# EAGLE design antenna (EAGLE 9.5.0)
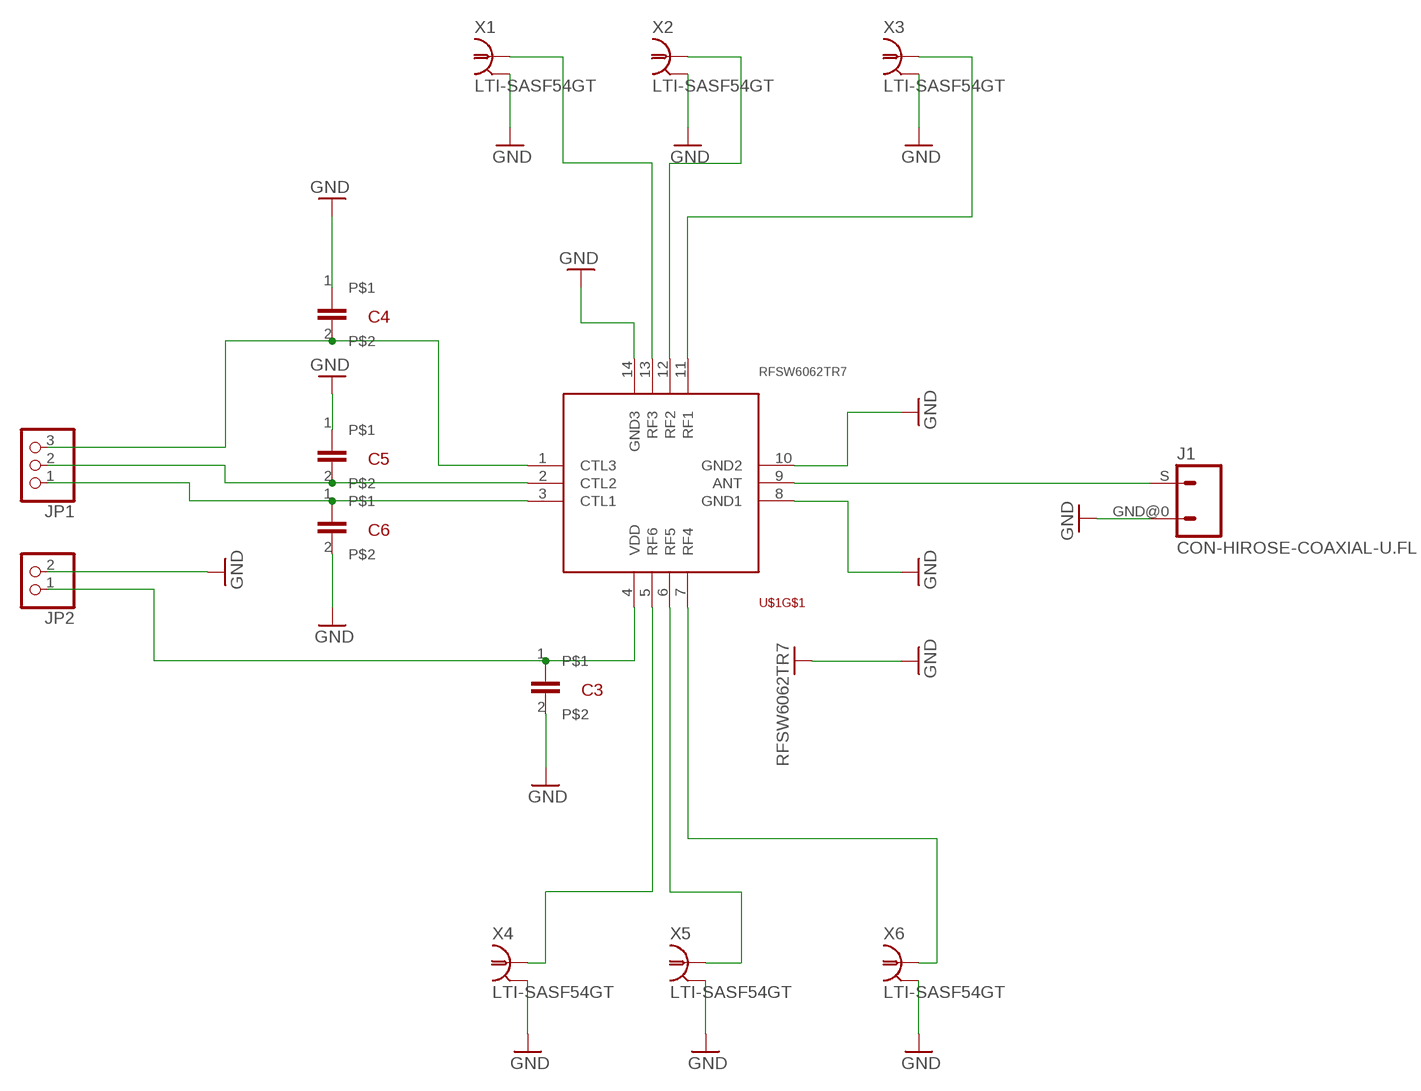
[diagram p0: schematic, sheet 1]

## Parts
C3  C3_0.01µF  [CAPC2012X78N]
C4  C8_100PF  [CAPC2012X78N]
C5  C8_100PF  [CAPC2012X78N]
C6  C8_100PF  [CAPC2012X78N]
J1  CON-HIROSE-COAXIAL-U.FL  [CON-U.FL]
JP1  PINHD-1X3  [1X03]
JP2  PINHD-1X2  [1X02]
U$1  RFSW6062TR7  [QFN40P200X200X55-15T98N]
X1  LTI-SASF54GT  [LTI-SASF54GT]
X2  LTI-SASF54GT  [LTI-SASF54GT]
X3  LTI-SASF54GT  [LTI-SASF54GT]
X4  LTI-SASF54GT  [LTI-SASF54GT]
X5  LTI-SASF54GT  [LTI-SASF54GT]
X6  LTI-SASF54GT  [LTI-SASF54GT]

## Nets
GND: C3.2 C4.1 C5.1 C6.2 J1.GND@0 JP2.2 U$1.8(GND1) U$1.10(GND2) U$1.14(GND3) U$1.15(GND) X1.2 X1.3 X1.4 X1.5 X2.2 X2.3 X2.4 X2.5 X3.2 X3.3 X3.4 X3.5 X4.2 X4.3 X4.4 X4.5 X5.2 X5.3 X5.4 X5.5 X6.2 X6.3 X6.4 X6.5
N$1: J1.S U$1.9(ANT)
N$3: C4.2 JP1.3 U$1.1(CTL3)
N$4: C5.2 JP1.2 U$1.2(CTL2)
N$5: C6.1 JP1.1 U$1.3(CTL1)
N$6: U$1.5(RF6) X4.1
N$7: U$1.6(RF5) X5.1
N$8: U$1.7(RF4) X6.1
N$9: U$1.13(RF3) X1.1
N$10: U$1.12(RF2) X2.1
N$11: U$1.11(RF1) X3.1
N$12: C3.1 JP2.1 U$1.4(VDD)

## Library data of the parts
C3 = CAPC3216X115N:C3_0.01µF: C0805X103J3GACTU 10 nF KEMET https://pl.mouser.com/ProductDetail/KEMET/C0805X103J3GACTU?qs=sGAEpiMZZMvsSlwiRhF8qtsBU8Zhqm2RMiIPEVgon9JfaolSOMg%252Baw%3D%3D
C4-C6 = CAPC3216X115N:C8_100PF: C0805C101F3HACTU KEMET https://pl.mouser.com/ProductDetail/KEMET/C0805C101F3HACTU?qs=sGAEpiMZZMs7ZEmUmaUL00DUlIL9lB1IrreY2%2FaCMQxOkMWiEAB29g%3D%3D
J1 = m-pad-2.1:CON-HIROSE-COAXIAL: Hirose SMT 50 ohm impedance connector W.FL ............................. 1.4mm mated height, ultra small SMT connectors .................................. DC to 3GHz U.FL .............................. 1.9mm or 2.4mm mated height, ultra small SMT connectors ................... DC to 6GHz E.FL ............................... 3.2mm mated height, ultra small SMT connectors .................................. DC to 2GHz H.FL .............................. 3.0mm mated height, ultra small SMT connectors ................................... DC to 3GHz S.FL. ............................. 6.0mm mated height, SMT connectors ................................................... DC to 2.5GHz FL ................................. 10.5mm mated height, SMT connectors .................................................. DC to 1.5GHz Please send any comments to: messi@users.sourceforge.net
JP1 = pinhead:PINHD-1X3: PIN HEADER
JP2 = pinhead:PINHD-1X2: PIN HEADER
U$1 = QFN40P200X200X55-15T98N:RFSW6062TR7: RFSW6062TR7 Qorvo https://pl.mouser.com/ProductDetail/Qorvo/RFSW6062TR7?qs=sGAEpiMZZMtsfndvJ9ArQ90bVKksKeudc9ZI3yCfIH4P%2FL2cBSq%252Bgw%3D%3D
X1-X6 = con-coax:LTI-SASF54GT: SMA vertical PCB thrue hole jack Source: Lighthorse Technologies, inc. SASF54GT.pdf; OC_FARNELL: unknown; OC_NEWARK: unknown

## Board
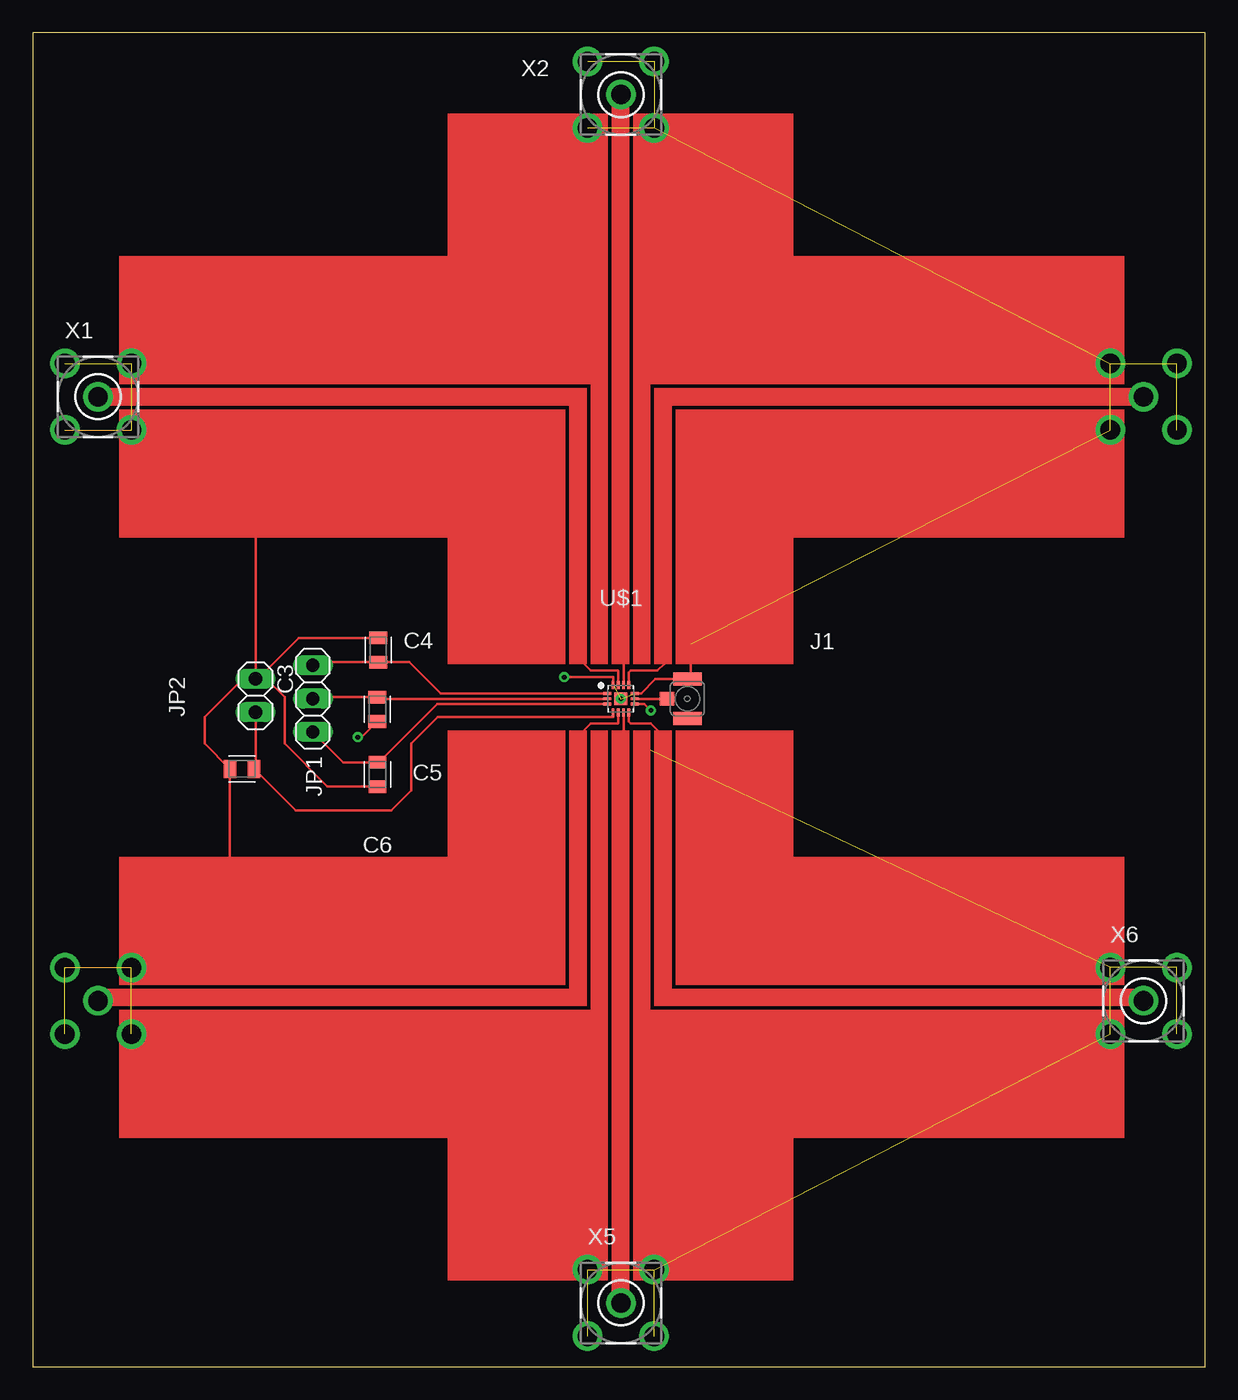
[diagram p1: board, top side]
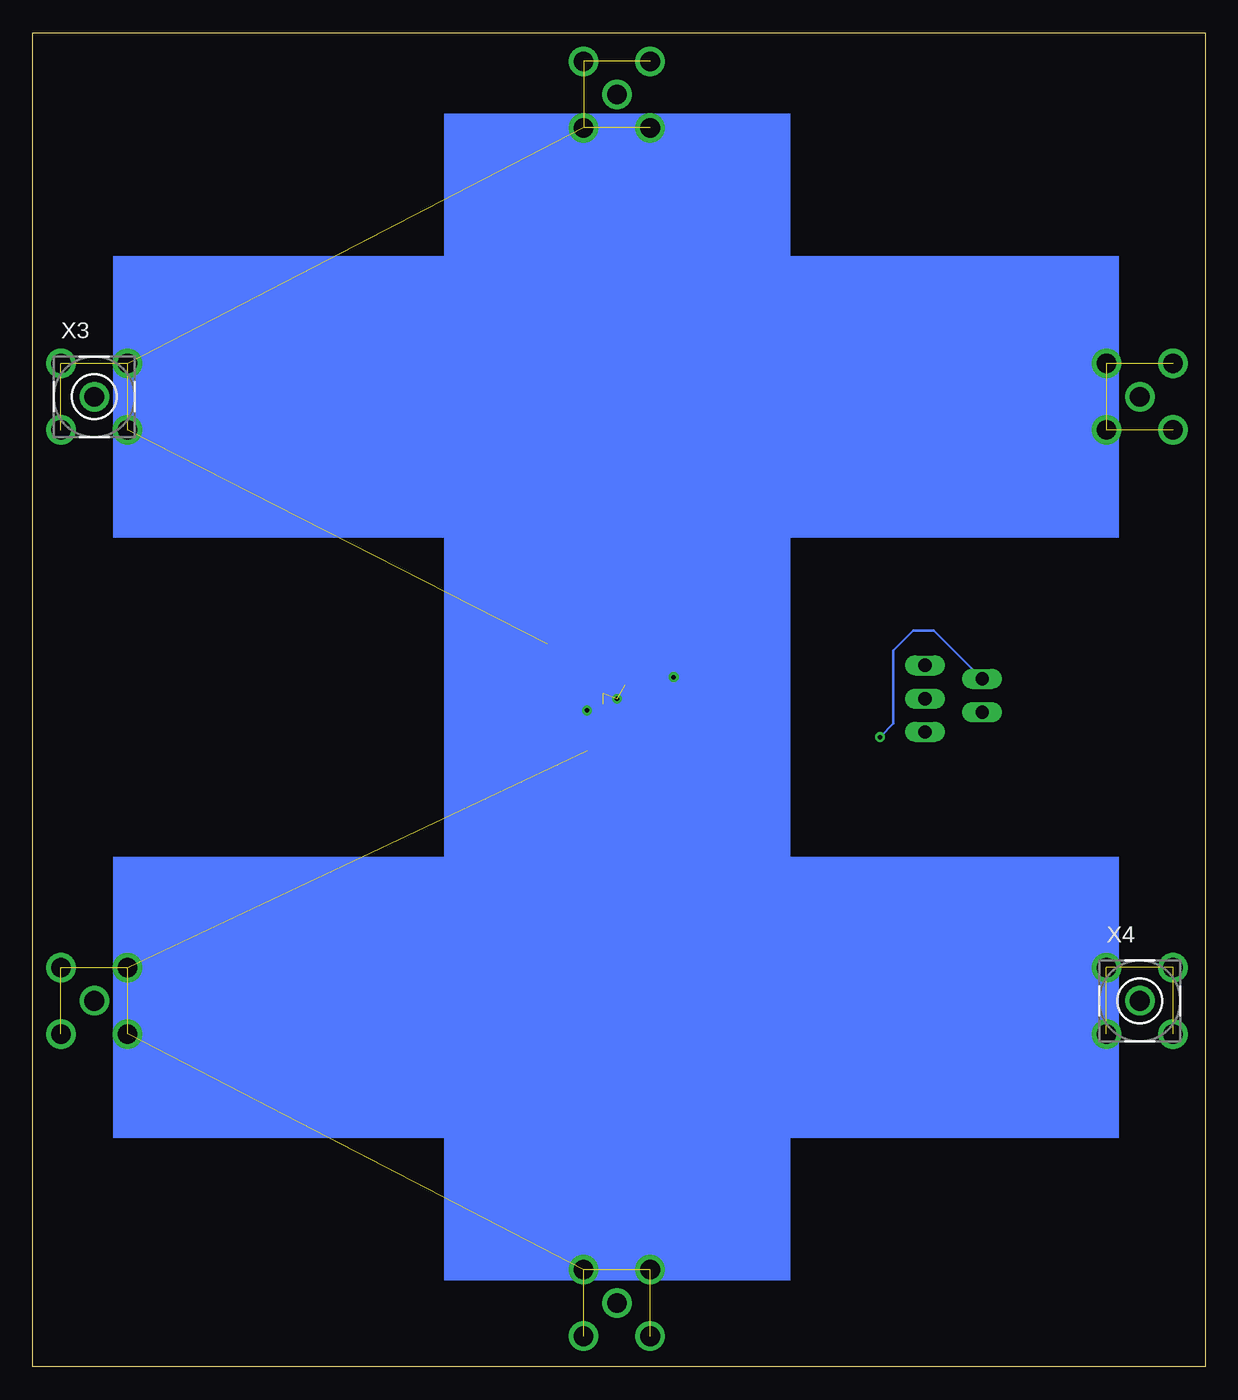
[diagram p2: board, bottom side, seen from below]

Size 89.42 x 101.79 mm. Coordinates in mm from the lower left corner, seen from the top.
Outline: 0,0 89.42,0 89.42,101.79 0,101.79 0,0
Copper layers (1*16): Top 0.035mm / dielectric 1.5mm / Bottom 0.035mm
Design rules "default": minimum track width 6mil, minimum drill 0.35mm, track to track 6mil, track to pad 6mil, pad to pad 6mil, via to via 6mil, smd to smd 6mil, copper to edge 40mil, drill to drill 6mil, minimum pad ring 10mil, minimum via ring 8mil, stop-mask expansion 4mil, vias tented up to drill 0mil, thermal gap 10mil

### Footprints (pad centres in the part's own frame; a part is rotated, then mirrored left to right if it is on the bottom)
CAPC2012X78N = smd 0.962 x 1.362: 1 -0.925,0; 2 0.925,0
CON-U.FL = smd 1 x 2.2: GND@0 -1.5,0; GND@1 1.5,0 | smd 1 x 1.1: S 0,-1.55
1X03 = drill 1.016 long: 1 -2.54,0; 2 0,0; 3 2.54,0
1X02 = drill 1.016 long: 1 -1.27,0; 2 1.27,0
QFN40P200X200X55-15T98N = smd 0.622 x 0.2: 1 -1.045,0.4; 2 -1.045,0; 3 -1.045,-0.4; 8 1.045,-0.4; 9 1.045,0; 10 1.045,0.4 | smd 0.2 x 0.622: 4 -0.6,-1.045; 5 -0.2,-1.045; 6 0.2,-1.045; 7 0.6,-1.045; 11 0.6,1.045; 12 0.2,1.045; 13 -0.2,1.045; 14 -0.6,1.045 | smd 0.98 x 0.98: 15 0,0
LTI-SASF54GT = drill 1.5 pad 2.2: 1 0,0; 2 -2.54,2.54; 3 2.54,2.54; 4 2.54,-2.54; 5 -2.54,-2.54

### Placement (x,y rotation side)
C3  15.96,45.62 180 top
C4  26.36,54.69 270 top
C5  26.29,50.16 90 top
C6  26.3,45.2 270 top
J1  49.94,50.97 270 top
JP1  21.36,50.98 90 top
JP2  17,51.22 90 top
U$1  44.86,50.97 0 top
X1  4.98,74.02 0 top
X2  44.86,97.07 0 top
X3  84.73,74.02 0 bottom
X4  4.98,27.92 0 bottom
X5  44.86,4.87 0 top
X6  84.73,27.92 0 top

### Tracks (layer width: path | path; a pad name or v marks a point on that pad's centre or on a via)
GND  (via drill 0.35)  (25 unrouted)
  Top 0.2: C6.2 22.47,44.27 19.2,47.54 19.2,51.1 17.81,52.49 17.17,52.49 | 17.17,52.49 JP2.2 | C4.1 20.3,55.61 17.17,52.49 | JP2.2 17,64.99 10.51,71.48 X1.4 | X4.2 15.04,37.97 C3.2 13.11,47.55 13.11,49.57 16.02,52.49 JP2.2 | C5.1 25.1,48.05 v24.79,48.05 | U$1.14 44.26,52.62 v40.54,52.62 | U$1.10 46.4,51.37 47.5,52.47 J1.GND@0 50.19,52.72 50.19,55.16 | U$1.8 46.66,50.57 v47.14,50.08
  Bottom 0.2: v40.54,52.62 40.54,53.64 36.48,57.7 36.48,65.32 30.32,71.48 X1.4 | v47.14,50.08 47.14,47.03 | v24.79,48.05 23.78,49.07 23.78,54.65 22.25,56.18 20.69,56.18 JP2.2
N$1
  Top 0.2: U$1.9 J1.S
N$2
  Bottom 0.2: 44.86,56.94 46.13,58.21
N$3
  Top 0.2: JP1.3 21.61,53.77 C4.2 28.73,53.77 31.12,51.37 U$1.1
N$4
  Top 0.2: U$1.2 26.4,50.97 C5.2 21.47,51.09 JP1.2
N$5
  Top 0.2: U$1.3 30.87,50.57 26.82,46.53 26.7,46.53 C6.1 23.68,46.12 JP1.1
N$6
  Top 0.2: X4.1 41.56,27.92 41.56,48.05 42.57,49.07 44.6,49.07 44.66,49.12 U$1.5
N$7
  Top 0.2: X5.1 44.86,48.05 45.06,48.25 U$1.6
N$8
  Top 0.2: X6.1 48.16,27.92 48.16,48.05 47.14,49.07 45.62,49.07 45.46,49.23 U$1.7
N$9
  Top 0.2: X1.1 41.56,74.02 41.56,54.15 42.57,53.13 44.6,53.13 44.66,53.07 U$1.13
N$10
  Top 0.2: X2.1 44.86,54.15 45.06,53.95 U$1.12
N$11
  Top 0.2: X3.1 48.16,74.02 48.16,53.64 47.65,53.13 45.62,53.13 45.46,52.97 U$1.11
N$12
  Top 0.2: JP2.1 17,45.73 C3.1 20.04,42.46 27.33,42.46 28.86,43.99 28.86,47.54 30.89,49.57 44.26,49.57 U$1.4
N$13  (via drill 0.35)
  Bottom 0.2: v44.86,50.97 44.86,54.02 44.1,54.78 39.4,54.78
(copper drawn outside any net)
  shapes: Bottom area x7, Top area x30